# Altium schematic sheet relays.SchDoc
size A4
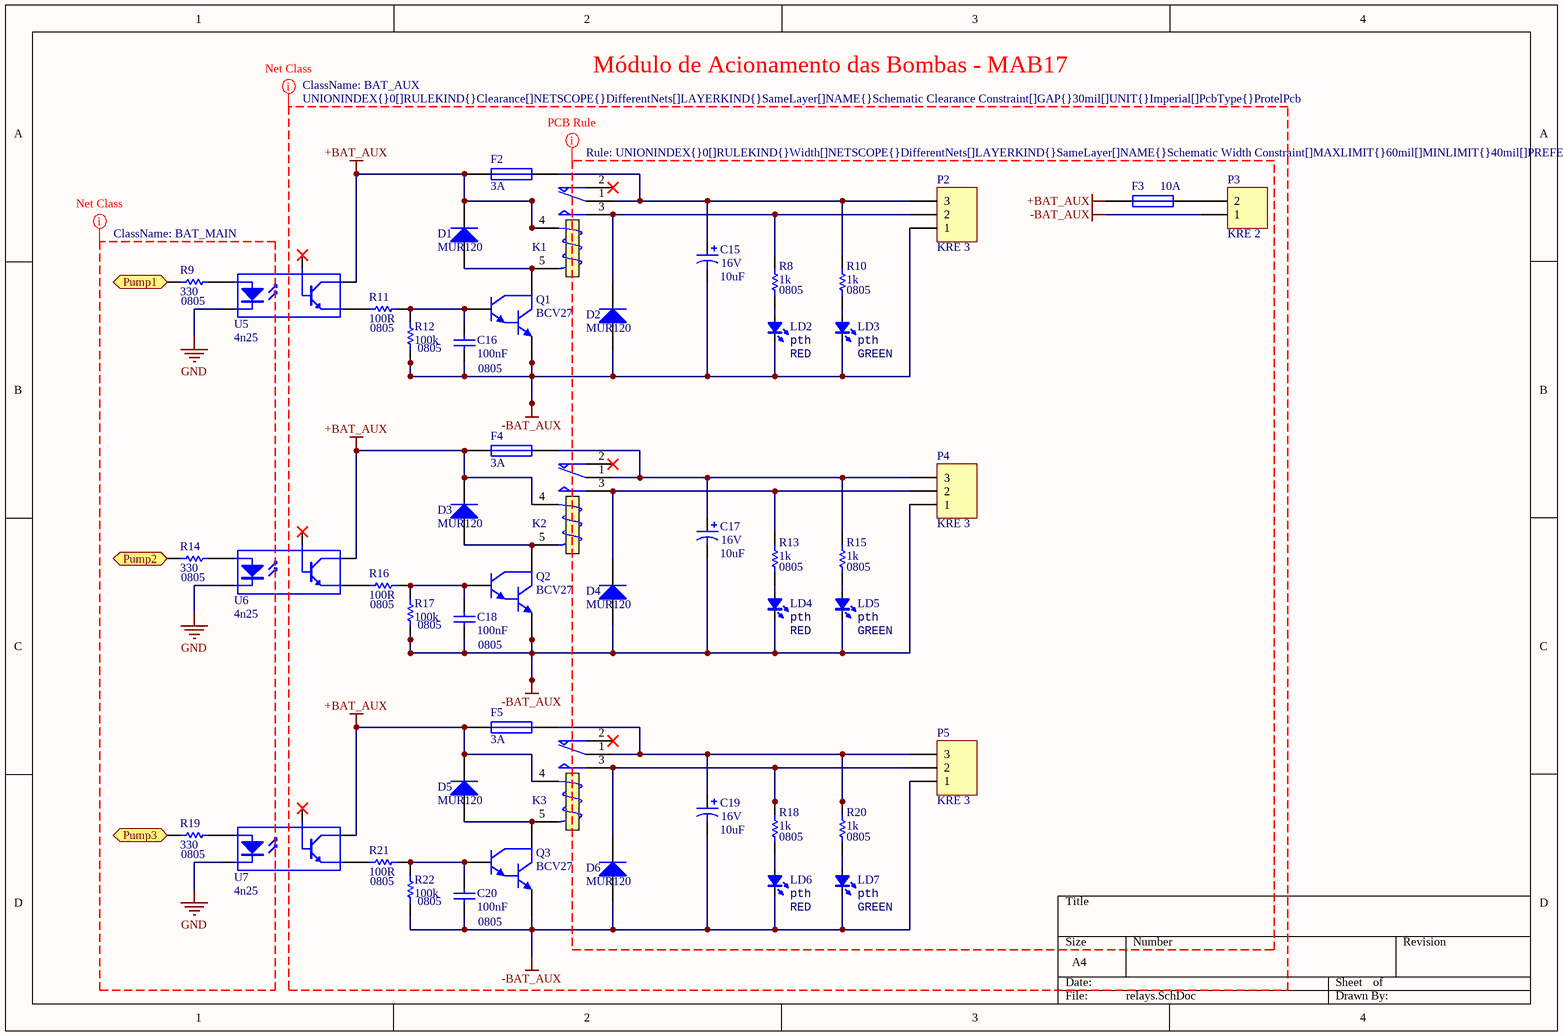
[diagram p0: relays.SchDoc]

## Parts
C15  Voltage: 16V  [cap10uF16V]  (hidden comment: 10uF)
C16  100nF  Footprint: 0805  [0805C]
C17  Voltage: 16V  [cap10uF16V]  (hidden comment: 10uF)
C18  100nF  Footprint: 0805  [0805C]
C19  Voltage: 16V  [cap10uF16V]  (hidden comment: 10uF)
C20  100nF  Footprint: 0805  [0805C]
D1  MUR120  [DIO10.2-7x2.7]
D2  MUR120  [DSO-C2/X2.3]
D3  MUR120  [DIO10.2-7x2.7]
D4  MUR120  [DSO-C2/X2.3]
D5  MUR120  [DIO10.2-7x2.7]
D6  MUR120  [DSO-C2/X2.3]
F2  3A  [Porta Fusivel]
F3  10A  [Porta Fusivel]
F4  3A  [Porta Fusivel]
F5  3A  [Porta Fusivel]
K1  (no value)  [RELE]
K2  (no value)  [RELE]
K3  (no value)  [RELE]
LD2  Type: pth  [LED3MM]  (hidden comment: RED)
LD3  Type: pth  [LED3MM]  (hidden comment: GREEN)
LD4  Type: pth  [LED3MM]  (hidden comment: RED)
LD5  Type: pth  [LED3MM]  (hidden comment: GREEN)
LD6  Type: pth  [LED3MM]  (hidden comment: RED)
LD7  Type: pth  [LED3MM]  (hidden comment: GREEN)
P2  KRE 3  [KRE_3]
P3  KRE 2  [KRE_2]
P4  KRE 3  [KRE_3]
P5  KRE 3  [KRE_3]
Q1  BCV27  [SOT95P240-3N]
Q2  BCV27  [SOT95P240-3N]
Q3  BCV27  [SOT95P240-3N]
R8  1k  Type: 0805  [0805R]
R9  330  Type: 0805  [0805R]
R10  1k  Type: 0805  [0805R]
R11  100R  Type: 0805  [0805R]
R12  100k  Type: 0805  [0805R]
R13  1k  Type: 0805  [0805R]
R14  330  Type: 0805  [0805R]
R15  1k  Type: 0805  [0805R]
R16  100R  Type: 0805  [0805C]
R17  100k  Type: 0805  [0805C]
R18  1k  Type: 0805  [0805R]
R19  330  Type: 0805  [0805R]
R20  1k  Type: 0805  [0805R]
R21  100R  Type: 0805  [0805C]
R22  100k  Type: 0805  [0805C]
U5  4n25  [SMD-6]
U6  4n25  [SMD-6]
U7  4n25  [SMD-6]

## Ports
Pump1 (in), Pump2 (in), Pump3 (in)

## Nets
+BAT_AUX: D1.2(K) D3.2(K) D5.2(K) F2.2 F3.2 F4.2 F5.2 K1.4(T1) K2.4(T1) K3.4(T1) U5.5(C) U6.5(C) U7.5(C)
-BAT_AUX: C15.2 C16.1 C17.2 C18.1 C19.2 C20.1 D2.1(A) D4.1(A) D6.1(A) LD2.2(K) LD3.2(K) LD4.2(K) LD5.2(K) LD6.2(K) LD7.2(K) P2.1 P3.1 P4.1 P5.1 Q1.3(E) Q2.3(E) Q3.3(E) R12.1 R17.1 R22.1
GND: U5.3(K) U6.3(K) U7.3(K)
Pump1: R9.1 ; port Pump1
Pump2: R14.1 ; port Pump2
Pump3: R19.1 ; port Pump3
NetC15_1: C15.1 F2.1 K1.1(COM) P2.3 R10.2
NetC16_2: C16.2 Q1.2(B) R11.1 R12.2
NetC17_1: C17.1 F4.1 K2.1(COM) P4.3 R15.2
NetC18_2: C18.2 Q2.2(B) R16.1 R17.2
NetC19_1: C19.1 F5.1 K3.1(COM) P5.3 R20.2
NetC20_2: C20.2 Q3.2(B) R21.1 R22.2
NetD1_1: D1.1(A) K1.5(T2) Q1.1(C)
NetD2_2: D2.2(K) K1.3(NO) P2.2 R8.2
NetD3_1: D3.1(A) K2.5(T2) Q2.1(C)
NetD4_2: D4.2(K) K2.3(NO) P4.2 R13.2
NetD5_1: D5.1(A) K3.5(T2) Q3.1(C)
NetD6_2: D6.2(K) K3.3(NO) P5.2 R18.2
NetF3_1: F3.1 P3.2
NetLD2_1: LD2.1(A) R8.1
NetLD3_1: LD3.1(A) R10.1
NetLD4_1: LD4.1(A) R13.1
NetLD5_1: LD5.1(A) R15.1
NetLD6_1: LD6.1(A) R18.1
NetLD7_1: LD7.1(A) R20.1
NetR9_2: R9.2 U5.1(A)
NetR11_2: R11.2 U5.4(E)
NetR14_2: R14.2 U6.1(A)
NetR16_2: R16.2 U6.4(E)
NetR19_2: R19.2 U7.1(A)
NetR21_2: R21.2 U7.4(E)

Not connected (* = marked no-connect by the designer): K1 2(NC)*; K2 2(NC)*; K3 2(NC)*; U5 6(B)*; U6 6(B)*; U7 6(B)*

## Layout directives
net class BAT_AUX; rule Clearance Constraint [Clearance = 30mil]: +BAT_AUX, -BAT_AUX
net class BAT_MAIN: GND
rule Width Constraint [Pref Width = 50mil    Min Width = 40mil    Max Width = 60mil]: +BAT_AUX, -BAT_AUX

## Notes on the sheet
- Módulo de Acionamento das Bombas - MAB17

## Library data of the parts
C15 C17 C19 = Cap Pol1: Polarized Capacitor (Radial); Type: pth; PackageReference: RB7.6-15; Value: 10uF
C16 C18 C20 = Cap: Capacitor; Voltage: 25V; Type: pth; PackageReference: RAD-0.3; Value: 100nF
D1-D6 = Diode: Default Diode; Type: pth; PackageReference: SMC; Value: MUR120
F2-F5 = Fuse 1: Fuse 5x20; PackageReference: PIN-W2/E2.8; Type: 5x20
  F2 F4 F5: Value: 3A
  F3: Value: 10A
K1-K3 = Relay: SPDT Relay; PackageReference: MODULE5B
LD2-LD7 = LED_0805: LED
  LD2 LD4 LD6: Value: RED
  LD3 LD5 LD7: Value: GREEN
P2 P4 P5 = Header 3: Header, 3-Pin; Type: KRE; Value: KRE 3
P3 = KRE_2: Terminal Block 1x2; Type: KRE; Value: KRE 2
Q1-Q3 = NPN1: NPN Darlington Bipolar Transistor; Type: TO-92; PackageReference: TO-92; Value: BCV27
R8-R22 = Res1: Resistor
  R8 R10 R13 R15 R18 R20: PackageReference: AXIAL-0.3; Value: 1k
  R9 R14 R19: PackageReference: AXIAL-0.3; Value: 330
  R11 R21: Value: 100R
  R12 R17 R22: Value: 100k
  R16: PackageReference: AXIAL-0.3; Value: 100R
U5-U7 = Optoisolator2: 5 Pin Mini Flat Pack Optocoupler; pin to pad: 3>2; PackageReference: SOP5(6); Type: SOP5(6); Value: 4n25